# EAGLE design Power_V2.0 (EAGLE 7.5.0)
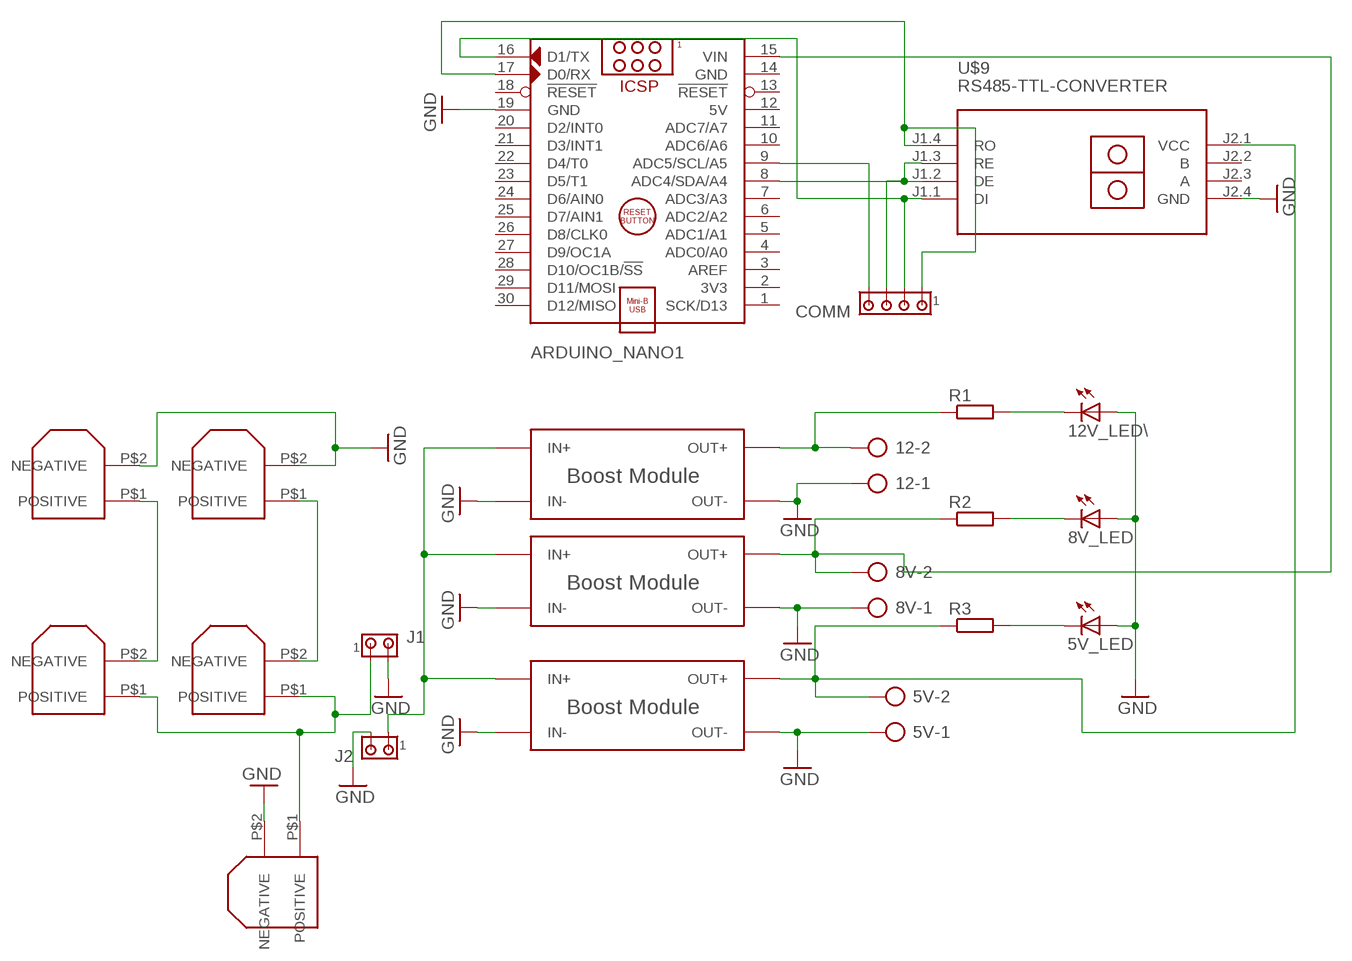
[diagram p0: schematic, sheet 1]

## Parts
5V  AK300/2  [AK300/2]
5V_LED  LED3MM  [LED3MM]
8V  AK300/2  [AK300/2]
8V_LED  LED3MM  [LED3MM]
12  AK300/2  [AK300/2]
12V_LED\  LED3MM  [LED3MM]
ARDUINO_NANO1  ARDUINO_NANO  [ARDUINO_NANO]
COMM  MTA04-100  [10X04MTA]
J1  MTA02-100  [10X02MTA]
J2  MTA02-100  [10X02MTA]
R1  R-EU_0204/7  [0204/7]
R2  R-EU_0204/7  [0204/7]
R3  R-EU_0204/7  [0204/7]
U$1  XT60  [CONNECTOR]
U$2  XT60  [CONNECTOR]
U$3  XT60  [CONNECTOR]
U$4  XT60  [CONNECTOR]
U$5  BOOST_MODULE  [BOOST_MODULE]
U$6  BOOST_MODULE  [BOOST_MODULE]
U$7  BOOST_MODULE  [BOOST_MODULE]
U$8  XT60  [CONNECTOR]
U$9  RS485-TTL-CONVERTER  [RS485-TTL-CONVERTER]

## Nets
GND: 5V.1 5V_LED.A 8V.1 8V_LED.A 12.1 12V_LED\.A ARDUINO_NANO1.19(GND) J1.2 J2.2 U$1.P$2(NEGATIVE) U$2.P$2(NEGATIVE) U$5.IN- U$5.OUT- U$6.IN- U$6.OUT- U$7.IN- U$7.OUT- U$8.P$2(NEGATIVE) U$9.J2.4(GND)
N$2: U$2.P$1(POSITIVE) U$4.P$2(NEGATIVE)
N$3: U$1.P$1(POSITIVE) U$3.P$2(NEGATIVE)
N$4: 8V.2 ARDUINO_NANO1.15(VIN) R2.1 U$5.OUT+
N$5: J2.1 U$5.IN+ U$6.IN+ U$7.IN+
N$6: 5V.2 R3.1 U$6.OUT+ U$9.J2.1(VCC)
N$7: 12V_LED\.K(C) R1.2
N$8: 8V_LED.K(C) R2.2
N$9: 5V_LED.K(C) R3.2
N$10: ARDUINO_NANO1.9(ADC5/SCL/A5) COMM.4
N$11: ARDUINO_NANO1.8(ADC4/SDA/A4) COMM.3 U$9.J1.2(DE) U$9.J1.3(RE)
N$12: ARDUINO_NANO1.17(D0/RX) COMM.1 U$9.J1.4(RO)
N$13: ARDUINO_NANO1.16(D1/TX) COMM.2 U$9.J1.1(DI)
N$14: J1.1 U$3.P$1(POSITIVE) U$4.P$1(POSITIVE) U$8.P$1(POSITIVE)
N$15: 12.2 R1.1 U$7.OUT+
Unconnected: ARDUINO_NANO1.1(SCK/D13) ARDUINO_NANO1.2(3V3) ARDUINO_NANO1.3(AREF) ARDUINO_NANO1.4(ADC0/A0) ARDUINO_NANO1.5(ADC1/A1) ARDUINO_NANO1.6(ADC2/A2) ARDUINO_NANO1.7(ADC3/A3) ARDUINO_NANO1.10(ADC6/A6) ARDUINO_NANO1.11(ADC7/A7) ARDUINO_NANO1.13(!RESET) ARDUINO_NANO1.18(!RESET) ARDUINO_NANO1.20(D2/INT0) ARDUINO_NANO1.21(D3/INT1) ARDUINO_NANO1.22(D4/T0) ARDUINO_NANO1.23(D5/T1) ARDUINO_NANO1.24(D6/AIN0) ARDUINO_NANO1.25(D7/AIN1) ARDUINO_NANO1.26(D8/CLK0) ARDUINO_NANO1.27(D9/OC1A) ARDUINO_NANO1.28(D10/OC1B/!SS) ARDUINO_NANO1.29(D11/MOSI) ARDUINO_NANO1.30(D12/MISO) U$9.J2.2(B) U$9.J2.3(A)

## Power pins joined to a net without a drawn wire
5V: ARDUINO_NANO1.12(5V)
GND: ARDUINO_NANO1.14(GND)

## Library data of the parts
5V 8V 12 = con-ptr500:AK300/2: CONNECTOR; OC_FARNELL: unknown; OC_NEWARK: unknown
5V_LED 8V_LED 12V_LED\ = adafruit:LED: LED OSRAM: - CHIPLED LG R971, LG N971, LY N971, LG Q971, LY Q971, LO R971, LY R971 LH N974, LH R974 LS Q976, LO Q976, LY Q976 LO Q996 - Hyper CHIPLED LW Q18S LB Q993, LB Q99A, LB R99A - SideLED LS A670, LO A670, LY A670, LG A670, LP A670 LB A673, LV A673, LT A673, LW A673 LH A674 LY A675 LS A676, LA A676, LO A676, LY A676, LW A676 LS A679, LY A679, LG A679 - Hyper Micro SIDELED® LS Y876, LA Y876, LO Y876, LY Y876 LT Y87S - SmartLED LW L88C, LW L88S LB L89C, LB L89S, LG L890 LS L89K, LO L89K, LY L89K LS L896, LA L896, LO L896, LY L896 - TOPLED LS T670, LO T670, LY T670, LG T670, LP T670 LSG T670, LSP T670, LSY T670, LOP T670, LYG T670 LG T671, LOG T671, LSG T671 LB T673, LV T673, LT T673, LW T673 LH T674 LS T676, LA T676, LO T676, LY T676, LB T676, LH T676, LSB T676, LW T676 LB T67C, LV T67C, LT T67C, LS T67K, LO T67K, LY T67K, LW E67C LS E67B, LA E67B, LO E67B, LY E67B, LB E67C, LV E67C, LT E67C LW T67C LS T679, LY T679, LG T679 LS T770, LO T770, LY T770, LG T770, LP T770 LB T773, LV T773, LT T773, LW T773 LH T774 LS E675, LA E675, LY E675, LS T675 LS T776, LA T776, LO T776, LY T776, LB T776 LHGB T686 LT T68C, LB T68C - Hyper Mini TOPLED® LB M676 - Mini TOPLED Santana® LG M470 LS M47K, LO M47K, LY M47K Source: http://www.osram.convergy.de/
ARDUINO_NANO1 = ArduinoNanoV30:ARDUINO_NANO: Arduino Nano V3.0 Module Overview: The Arduino Nano is a small, complete, and breadboard-friendly board based on the ATmega328 (Arduino Nano 3.x) or ATmega168 (Arduino Nano 2.x). It has more or less the same functionality of the Arduino Duemilanove, but in a different package. It lacks only a DC power jack, and works with a Mini-B USB cable instead of a standard one. The Nano was designed and is being produced by Gravitech <http://www.gravitech.us/arna30wiatp.html>. General specifications: Item Value Microcontroller Atmel ATmega168 or ATmega328 Operating Voltage (logic level) 5 V Input Voltage (recommended) 7-12 V Input Voltage (limits) 6-20 V Digital I/O Pins 14 (of which 6 provide PWM output) Analog Input Pins 8 DC Current per I/O Pin 40 mA Flash Memory 16 KB (ATmega168) or 32 KB (ATmega328) of which 2 KB used by bootloader SRAM 1 KB (ATmega168) or 2 KB (ATmega328) EEPROM 512 bytes (ATmega168) or 1 KB (ATmega328) Clock Speed 16 MHz Dimensions (Inches) 0.73" x 1.70" Dimensions (mm) 18mm x 45mm Overall height About 9 mm (not including pins) Weigth 5 g Power: The Arduino Nano can be powered via the Mini-B USB connection, 6-20V unregulated external power supply (pin 30), or 5V regulated external power supply (pin 27). The power source is automatically selected to the highest voltage source. Memory: The ATmega168 has 16 KB of flash memory for storing code (of which 2 KB is used for the bootloader); the ATmega328 has 32 KB, (also with 2 KB used for the bootloader). The ATmega168 has 1 KB of SRAM and 512 bytes of EEPROM (which can be read and written with the EEPROM library); the ATmega328 has 2 KB of SRAM and 1 KB of EEPROM. Input and Output: Each of the 14 digital pins on the Nano can be used as an input or output, using pinMode(), digitalWrite(), and digitalRead() functions. They operate at 5 volts. Each pin can provide or receive a maximum of 40 mA and has an internal pull-up resistor (disconnected by default) of 20-50 kOhms. In addition, some pins have specialized functions. Visit Arduino - ArduinoBoardNano <https://www.arduino.cc/en/Main/ArduinoBoardNano>
COMM = con-amp:MTA04-100: AMP connector
J1 J2 = con-amp:MTA02-100: AMP connector
R1-R3 = resistor:R-EU_: RESISTOR, European symbol
U$1-U$4 U$8 = xt60_V2:XT60
U$5-U$7 = Boost Module:BOOST_MODULE
U$9 = diy-modules:RS485-TTL-CONVERTER: RS485 to TTL converter based on MAX485 chip

## Board
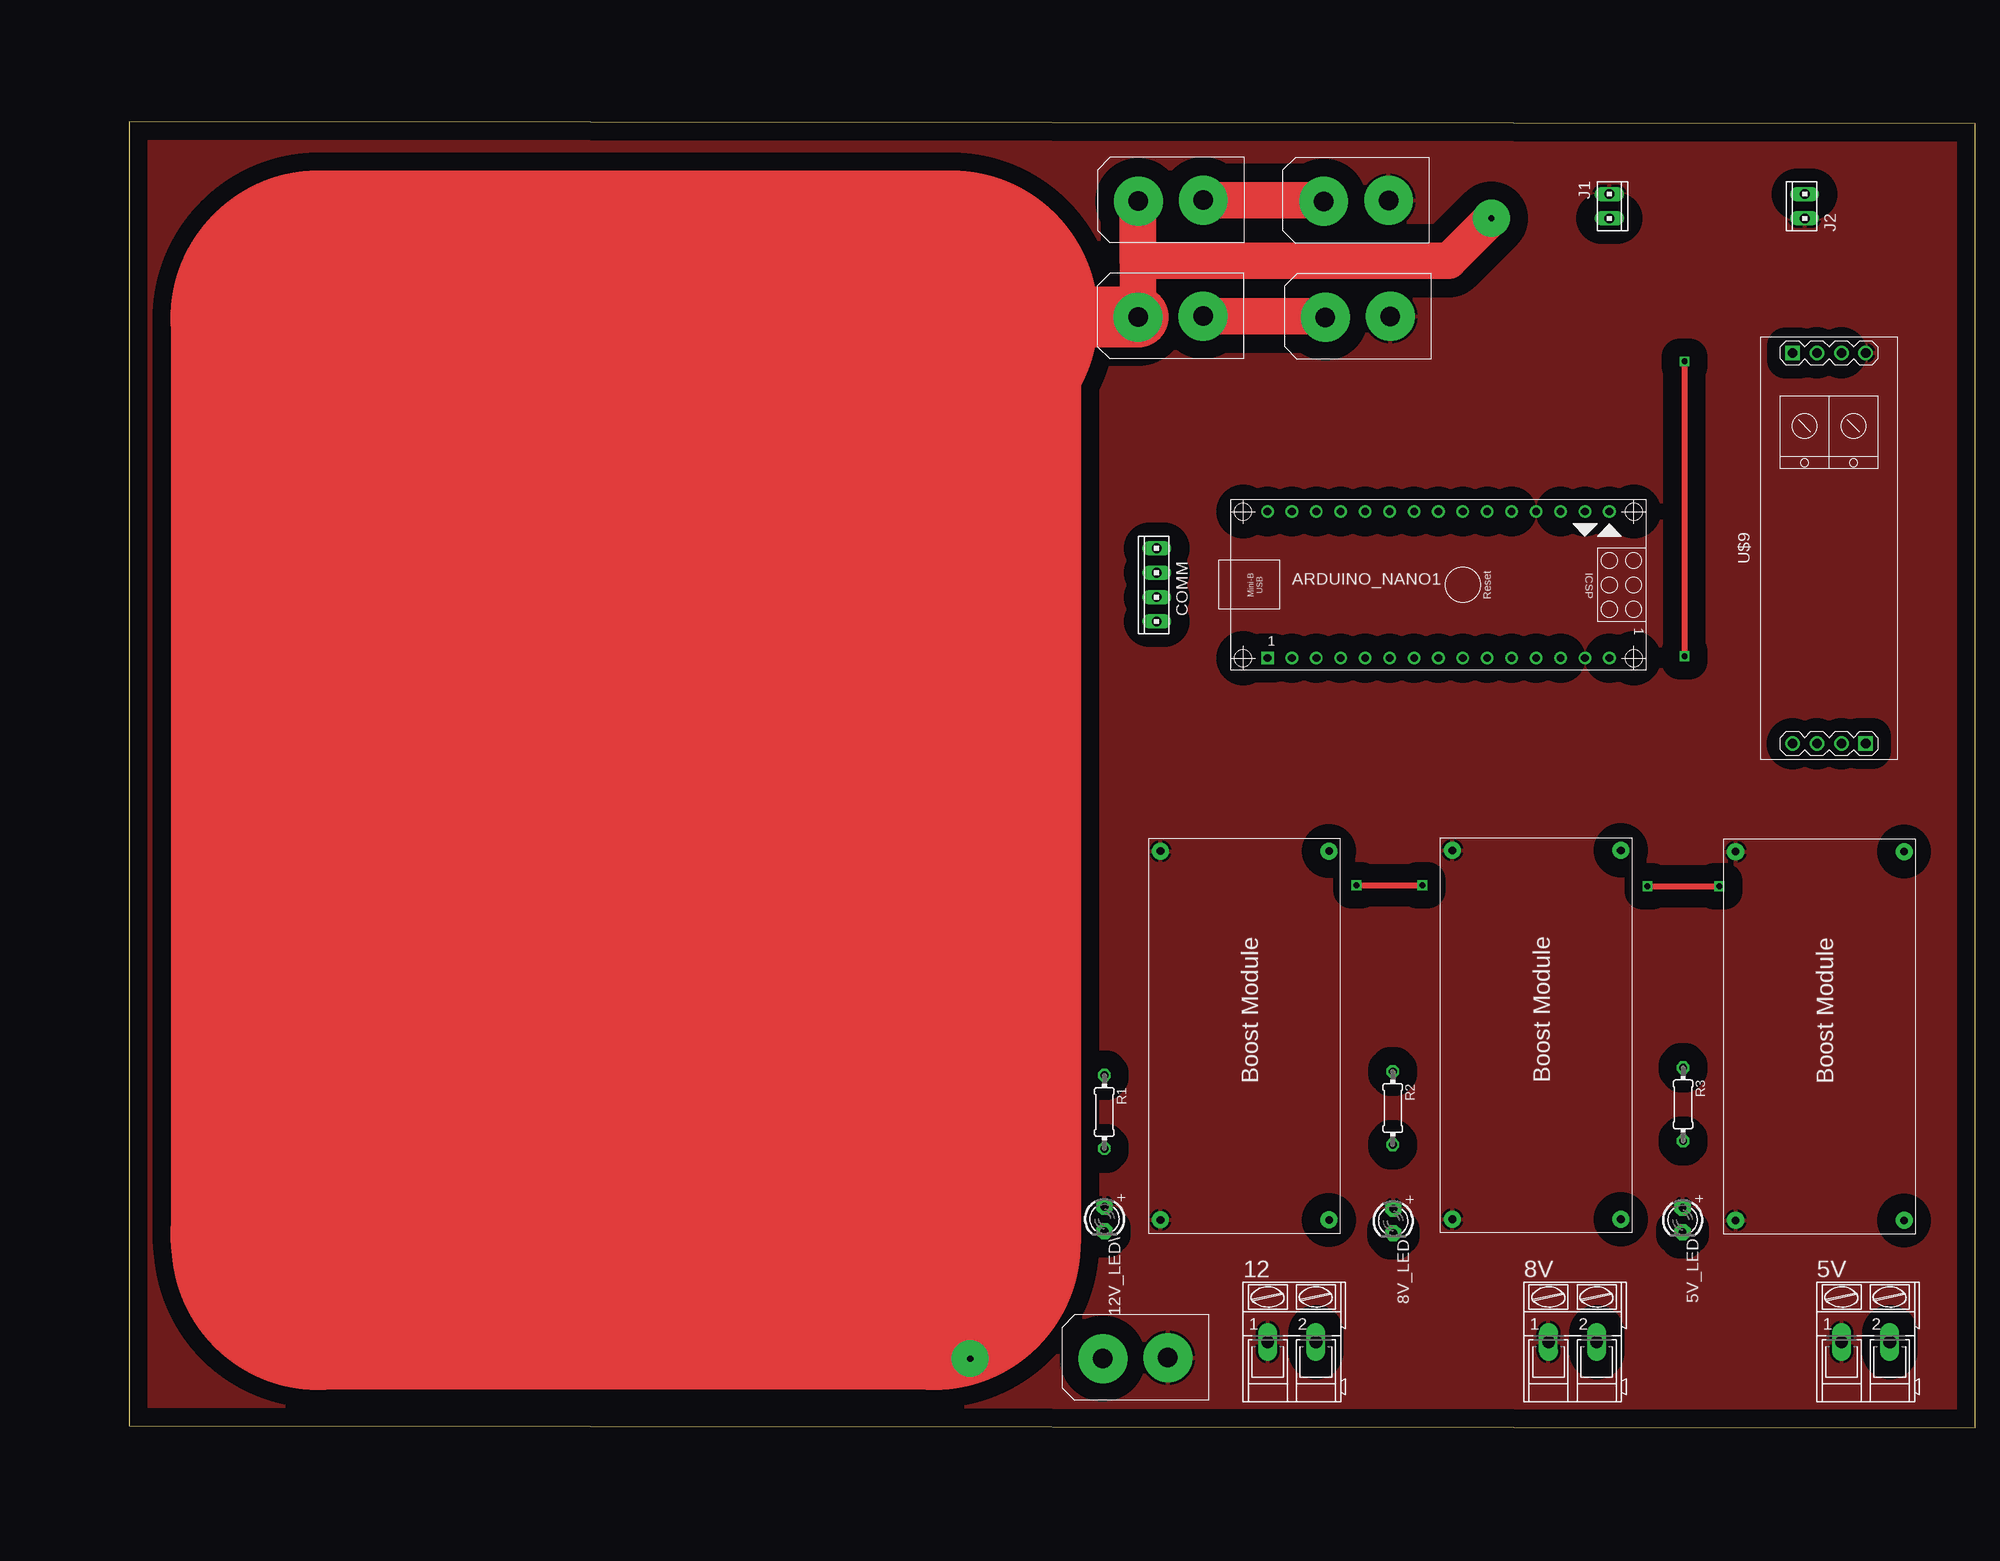
[diagram p1: board, top side]
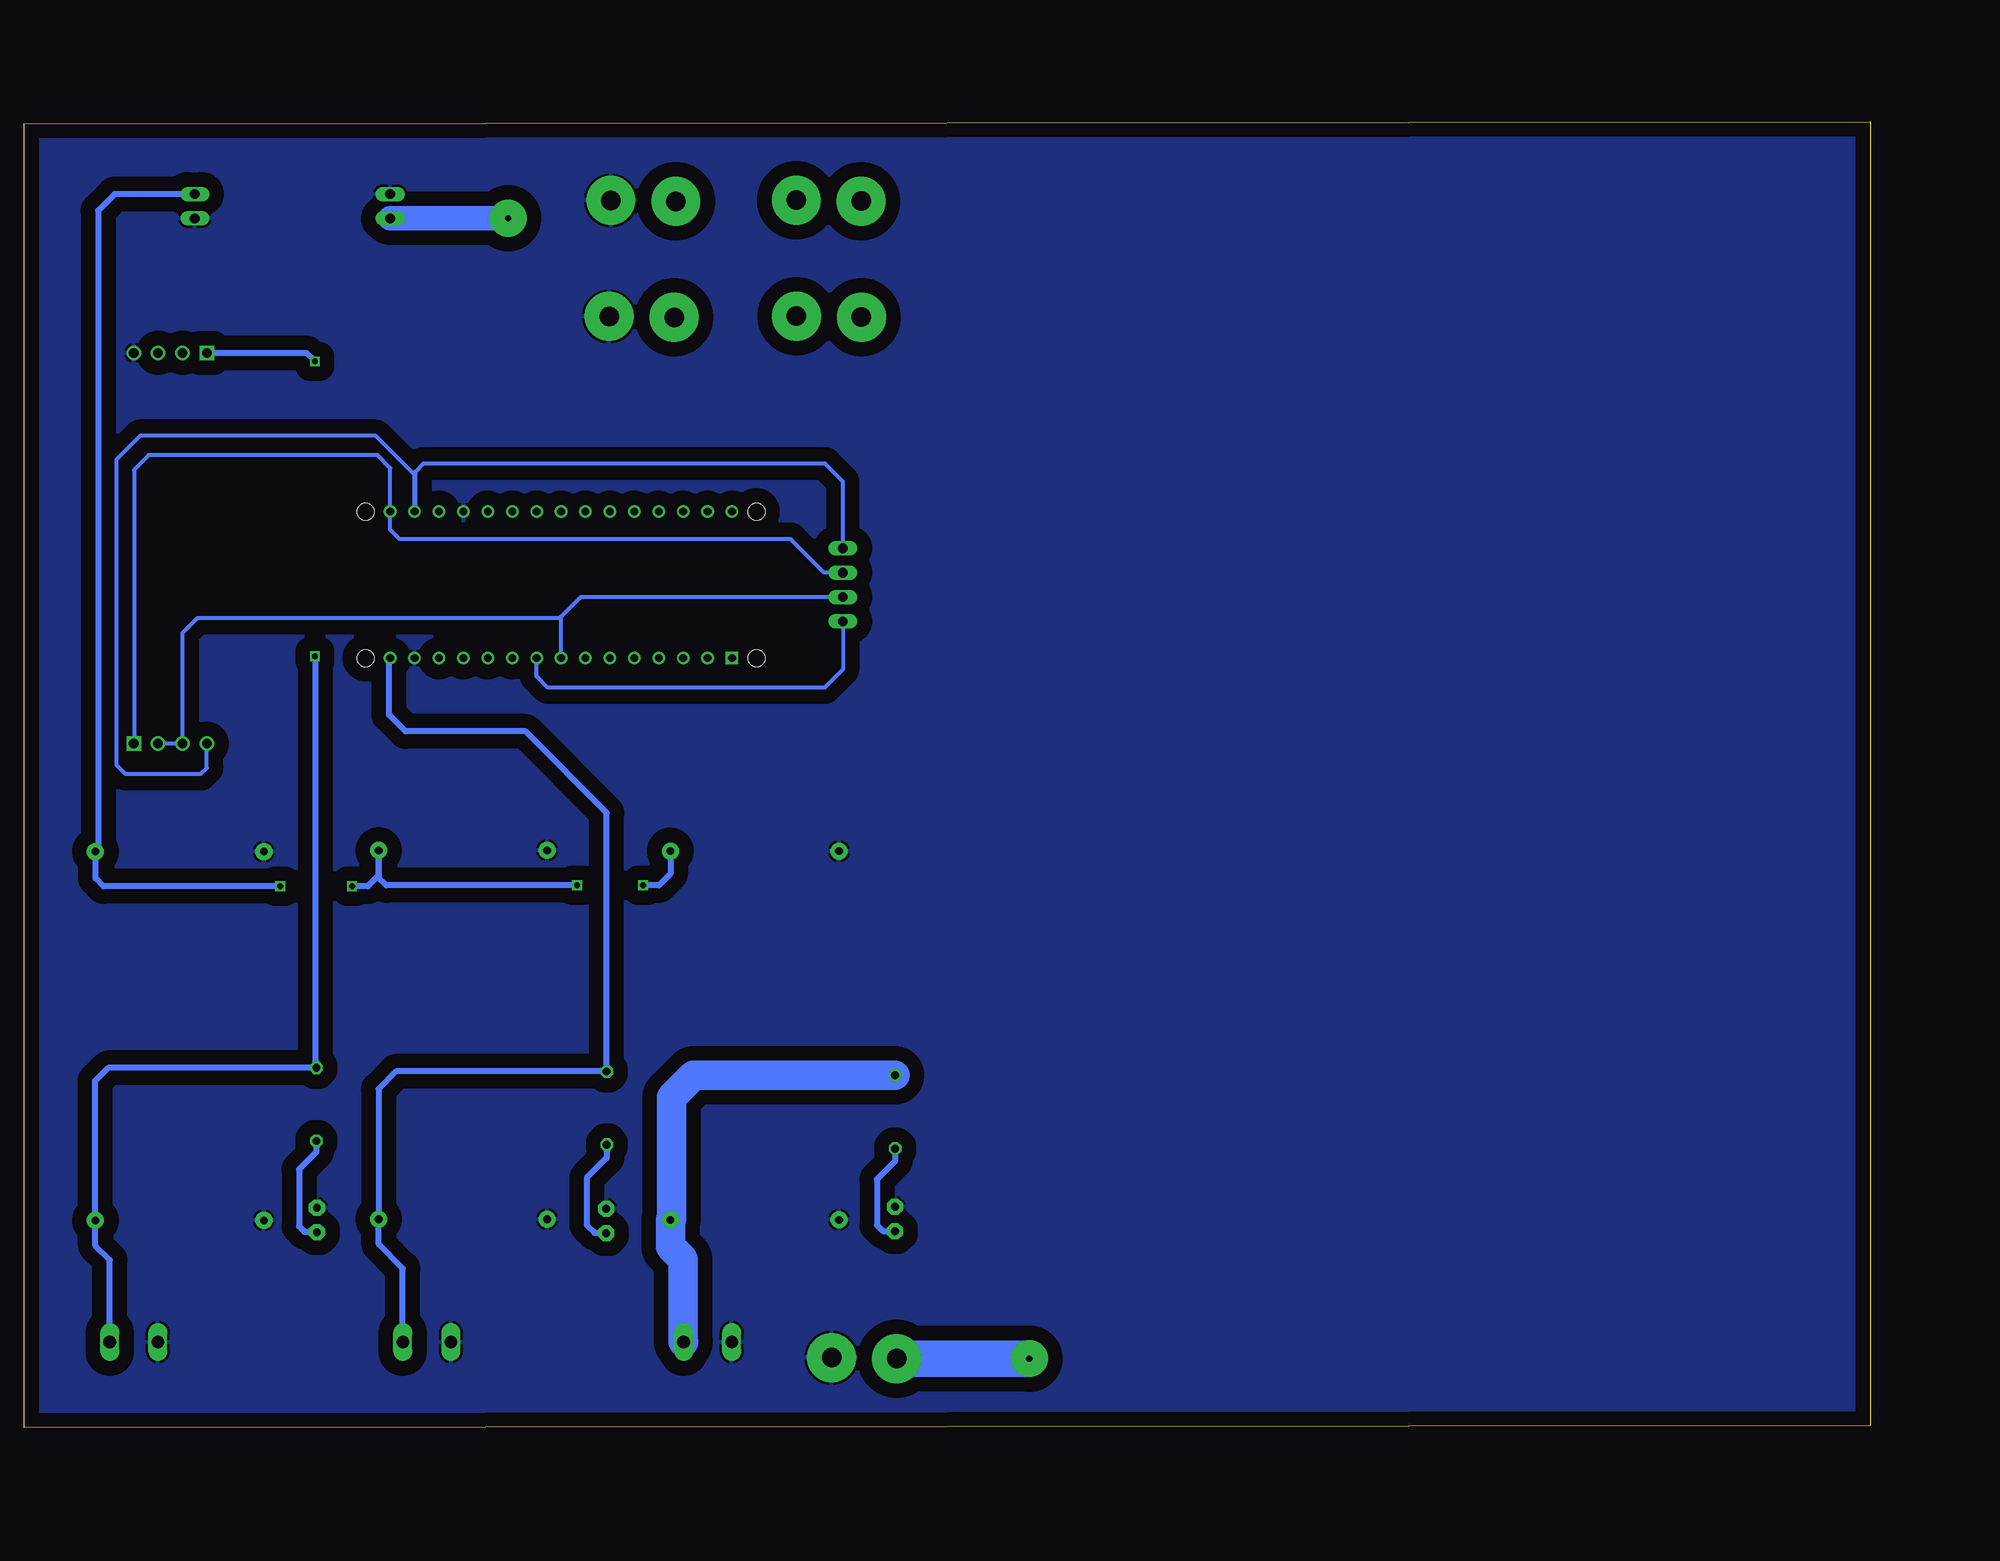
[diagram p2: board, bottom side, seen from below]

Size 192.05 x 135.76 mm. Coordinates in mm from the lower left corner, seen from the top.
Outline: 0,0.2 192.05,0 192.05,135.56 0,135.76 0,0.2
Copper layers (1*16): Top 0.035mm / dielectric 1.5mm / Bottom 0.035mm
Design rules "default": minimum track width 10mil, minimum drill 24mil, track to track 8mil, track to pad 8mil, pad to pad 8mil, via to via 8mil, smd to smd 8mil, copper to edge 40mil, drill to drill 8mil, minimum pad ring 10mil, minimum via ring 8mil, stop-mask expansion 4mil, vias tented up to drill 0mil, thermal gap 10mil

### Footprints (pad centres in the part's own frame; a part is rotated, then mirrored left to right if it is on the bottom)
AK300/2 = drill 1.321 long: 1 -2.515,0; 2 2.489,0
LED3MM = drill 0.813 pad 1.676 octagon: A -1.27,0; K 1.27,0
ARDUINO_NANO = drill 0.8 square: 1 -20.32,-7.62 | drill 0.8: 2 -17.78,-7.62; 3 -15.24,-7.62; 4 -12.7,-7.62; 5 -10.16,-7.62; 6 -7.62,-7.62; 7 -5.08,-7.62; 8 -2.54,-7.62; 9 0,-7.62; 10 2.54,-7.62; 11 5.08,-7.62; 12 7.62,-7.62; 13 10.16,-7.62; 14 12.7,-7.62; 15 15.24,-7.62; 16 15.24,7.62; 17 12.7,7.62; 18 10.16,7.62; 19 7.62,7.62; 20 5.08,7.62; 21 2.54,7.62; 22 0,7.62; 23 -2.54,7.62; 24 -5.08,7.62; 25 -7.62,7.62; 26 -10.16,7.62; 27 -12.7,7.62; 28 -15.24,7.62; 29 -17.78,7.62; 30 -20.32,7.62 | hole 1.778: -22.86,-7.62; -22.86,7.62; 17.78,7.62; 17.78,-7.62
10X04MTA = drill 1.016 long: 1 3.81,0; 2 1.27,0; 3 -1.27,0; 4 -3.81,0
10X02MTA = drill 1.016 long: 1 1.27,0; 2 -1.27,0
0204/7 = drill 0.813 octagon: 1 -3.81,0; 2 3.81,0
CONNECTOR = drill 2.032 pad 5.08: P$1 4.343,12.294; P$2 4.445,5.537
BOOST_MODULE = drill 0.8 pad 1.778: IN+ 1.27,18.796; IN- 1.27,1.27; OUT+ 39.624,18.796; OUT- 39.624,1.27
RS485-TTL-CONVERTER = drill 1 square: J1.1 -20.32,-3.81; J2.1 20.32,3.81 | drill 1: J1.2 -20.32,-1.27; J1.3 -20.32,1.27; J1.4 -20.32,3.81; J2.2 20.32,1.27; J2.3 20.32,-1.27; J2.4 20.32,-3.81

### Placement (x,y rotation side)
5V  180.64,8.89 0 top
5V_LED  161.59,21.59 270 top
8V  150.16,8.89 0 top
8V_LED  131.5,21.49 270 top
12  120.95,8.89 0 top
12V_LED\  101.47,21.69 270 top
ARDUINO_NANO1  138.73,87.63 0 top
COMM  106.88,87.63 90 top
J1  153.97,127 270 top
J2  174.29,127 90 top
R1  101.45,32.82 270 top
R2  131.44,33.22 270 top
R3  161.65,33.6 270 top
U$1  136.55,123.16 90 top
U$2  136.73,111.1 90 top
U$3  117.27,123.19 90 top
U$4  117.25,111.12 90 top
U$5  136.37,61.29 270 top
U$6  165.84,61.16 270 top
U$7  106.02,61.21 270 top
U$8  113.59,2.82 90 top
U$9  176.83,91.44 90 top

### Tracks (layer width: path | path; a pad name or v marks a point on that pad's centre or on a via)
GND
  pour Top (isolate 1.905): 192.43,135.56 192.43,0.28 -4.06,-0.2 -4.06,135.13
  pour Bottom (isolate 1.524): -2.24,136.55 193.62,136.75 193.62,-1.24 -2.24,-1.45
N$1  (via drill 0.64 pad 3.81)
  other vias: 87.5,7.16
N$2
  Top 3.81: U$4.P$2 124.43,115.57 U$2.P$1
N$3
  Top 3.81: U$3.P$2 124.26,127.64 U$1.P$1
N$4
  Bottom 0.61: ARDUINO_NANO1.15 154.1,79.88 154.1,74.12 152.37,72.39 139.9,72.39 131.44,63.93 R2.1 153.36,37.03 155.19,35.2 155.19,21.69 U$5.OUT+ 155.17,19.05 152.65,16.54 8V.2
N$5  (via drill 0.6)
  Top 0.61: v127.66,56.39 v134.52,56.39 | v157.94,56.29 v165.4,56.29
  Bottom 0.61: J2.1 182.63,128.27 184.35,126.54 184.35,60.17 U$6.IN+ 184.61,59.87 184.61,57.1 183.79,56.29 v165.4,56.29 | U$7.IN+ 124.82,57.58 126.01,56.39 v127.66,56.39 | v134.52,56.39 154.36,56.39 155.14,57.17 155.14,59.99 U$5.IN+ 155.17,57.43 156.31,56.29 v157.94,56.29
N$6  (via drill 0.6)
  Top 0.61: v161.8,110.87 v161.8,80.21
  Bottom 0.61: U$9.J2.1 162.69,111.76 v161.8,110.87 | v161.8,80.21 161.8,37.57 R3.1 183.29,37.41 184.68,36.02 184.68,21.59 U$6.OUT+ 184.63,18.92 183.13,17.42 5V.2
N$7
  Bottom 0.61: R1.2 101.45,27.71 103.35,25.81 103.35,21.06 102.72,20.42 12V_LED\.K
N$8
  Bottom 0.61: R2.2 131.44,28.04 133.53,25.96 133.53,21.06 132.71,20.24 131.52,20.24 8V_LED.K
N$9
  Bottom 0.61: R3.2 161.65,28.65 163.45,26.85 163.45,20.93 162.86,20.34 161.62,20.34 5V_LED.K
N$10
  Bottom 0.406: COMM.4 106.88,78.84 108.79,76.94 137.59,76.94 138.76,78.11 138.76,79.98 ARDUINO_NANO1.9
N$11
  Bottom 0.406: COMM.3 134.16,86.36 136.21,84.31 136.25,84.28 | 136.25,84.28 136.25,80.06 ARDUINO_NANO1.8 | U$9.J1.2 U$9.J1.3 175.56,82.63 173.99,84.2 136.32,84.2 136.25,84.28
N$12
  Bottom 0.406: COMM.1 106.88,98.37 108.74,100.23 150.52,100.23 151.38,99.36 151.38,95.3 ARDUINO_NANO1.17 151.43,99.06 155.5,103.12 179.98,103.12 182.45,100.66 182.45,68.91 181.51,67.97 173.66,67.97 173.05,68.58 173.05,71.09 U$9.J1.4
N$13
  Bottom 0.406: COMM.2 108.84,88.9 112.32,92.38 152.98,92.38 153.95,93.34 153.95,95.22 | 153.95,95.22 ARDUINO_NANO1.16 | 153.95,95.22 153.95,99.77 155.3,101.12 179.1,101.12 180.62,99.59 180.62,71.14 U$9.J1.1
N$14  (via drill 0.64 pad 3.81)
  Top 2.54: 19.66,20.93 87.48,20.93 v87.48,7.16
  Top 3.81: U$4.P$1 104.95,127.53 U$3.P$1 104.9,127.53 104.9,121.31 137.26,121.31 v141.71,125.75
  Top 30.48: 85.57,115.47 19.66,115.47 19.56,115.37 19.56,20.07 19.76,19.86 46.18,19.86 46.38,19.66 46.38,103.81 42.95,107.24 59.87,107.24 59.87,94.74 63.09,94.74 63.09,92.02 48.08,92.02 48.08,19.66 68.4,19.66 68.4,94.41 73.51,94.41 73.51,20.02 82.91,20.02 82.91,110.49 83.77,110.49 83.77,19.15 19.66,19.15 19.66,20.93
  Top 6.35: U$4.P$1 85.57,115.47
  Bottom 2.54: v141.71,125.75 153.95,125.75 J1.1
  Bottom 3.81: v87.48,7.16 U$8.P$1
N$15
  Bottom 0.61: 124.89,21.67 U$7.OUT+ 124.84,21.57
  Bottom 3.048: R1.1 122.43,36.63 124.69,34.37 124.69,21.72 U$7.OUT+ 124.82,18.8 123.49,17.48 123.49,8.94 12.2